# Altium project CT_Entire_Project.PrjPcb
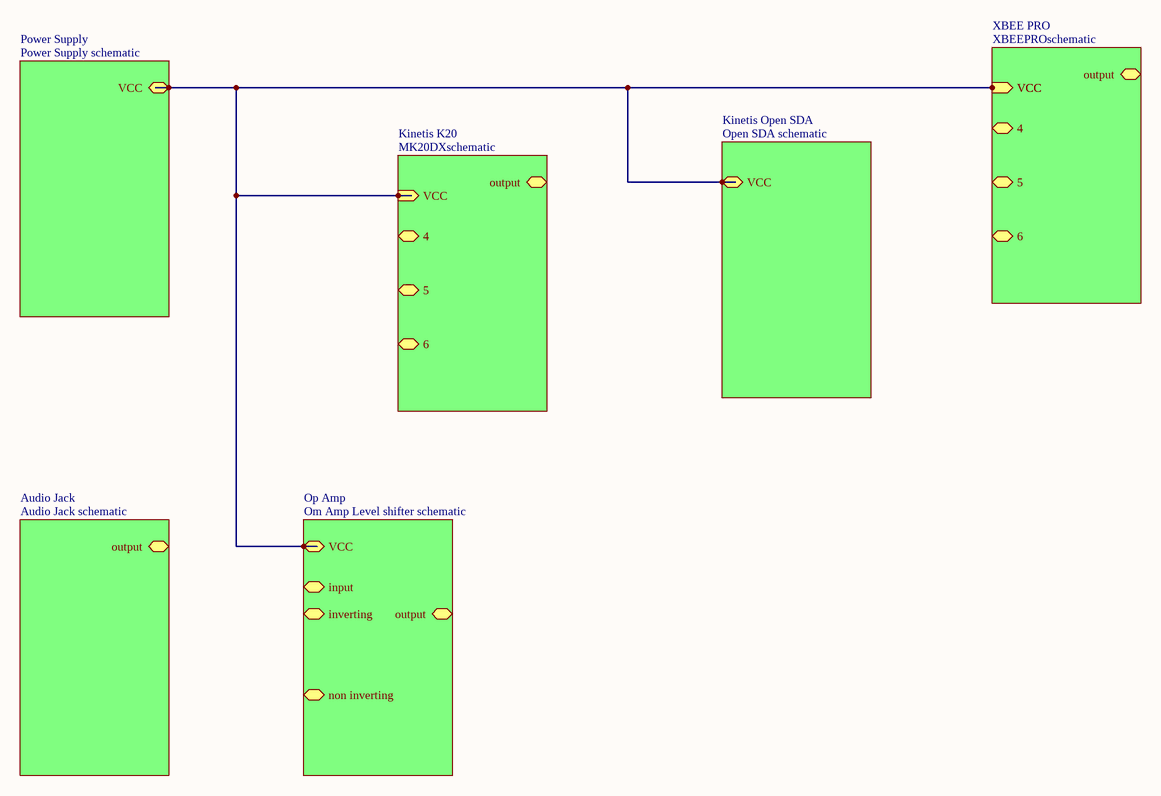
[diagram p0: CT_MET_2.SchDoc]
5 sheets, 18 parts. Net scope: hierarchical (ports join the sheet entries above them; power ports are global).
Sheets:
  CT_MET_2.SchDoc
    Power Supply = Power Supply schematic.SchDoc
    Kinetis K20 = MK20DXschematic.SchDoc
    XBEE PRO = XBEEPROschematic.SchDoc
    Kinetis Open SDA = Open SDA schematic.SchDoc

## Sheet CT_MET_2.SchDoc
size A4

### Sub-sheets
Audio Jack = Audio Jack schematic (file not in this document): output
Kinetis K20 = MK20DXschematic: output, 4, 5, 6, VCC (in)
Kinetis Open SDA = Open SDA schematic: VCC
Op Amp = Om Amp Level shifter schematic (file not in this document): inverting, output, non inverting, VCC, input
Power Supply = Power Supply schematic: VCC
XBEE PRO = XBEEPROschematic: output, VCC, 4, 5, 6, VCC (in)

### Nets
NetC?#3_1: sheet Op Amp/VCC, sheet Power Supply/VCC, sheet Kinetis K20/VCC, sheet XBEE PRO/VCC, sheet XBEE PRO/VCC, sheet Kinetis Open SDA/VCC

## Sheet Power Supply schematic.SchDoc
size A4
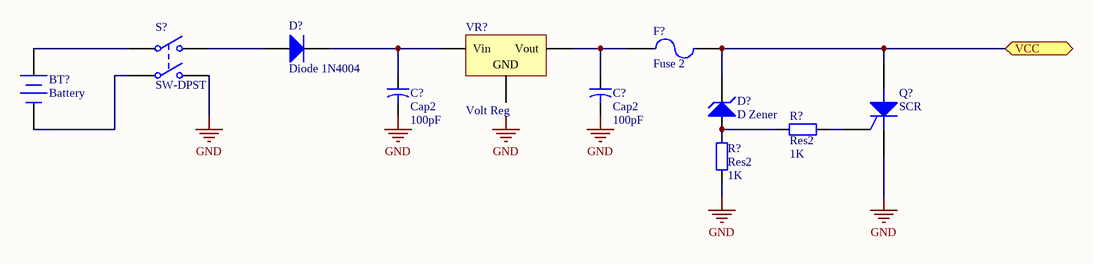
[diagram p1: Power Supply schematic.SchDoc]

### Parts
(Parts that share a designator on the sheet are numbered #1, #2 ... from top to bottom, then left to right.)
BT?  Battery  [BAT-2]
C?#1  Cap2  value 100pF  [CAPR5-4X5]
C?#2  Cap2  value 100pF  [CAPR5-4X5]
D?#1  Diode 1N4004  [DO-41]
D?#2  D Zener  [DIODE-0.7]
F?  Fuse 2  [PIN-W2/E2.8]
Q?  SCR  [TO-220-AB]
R?#1  Res2  value 1K  [AXIAL-0.4]
R?#2  Res2  value 1K  [AXIAL-0.4]
S?  SW-DPST  [DPST-4]
VR?  Volt Reg  [D2PAK_N]

### Ports
VCC

### Nets
GND: C?#1.2 C?#2.2 Q?.3(K) R?#2.1 S?.4(NO2)
NetBT?_1: BT?.1(+) S?.1(COMMON1)
NetBT?_2: BT?.2(-) S?.3(COMMON2)
NetC?#1_1: C?#1.1 D?#1.2(K) VR?.1(Vin)
NetC?#2_1: C?#2.1 F?.1 VR?.3(Vout)
NetC?#3_1: D?#2.2(K) F?.2 Q?.1(A) ; port VCC
NetD?#1_1: D?#1.1(A) S?.2(NO1)
NetD?#2_1: D?#2.1(A) R?#1.2 R?#2.2
NetQ?_2: Q?.2(G) R?#1.1

Not connected (* = marked no-connect by the designer): VR? 2(GND)

### Notes on the sheet
- Labels drawn without touching a wire or pin: GND

### Library data of the parts
BT? = Battery: Multicell Battery; Published: 24-Mar-1999; LatestRevisionDate: 17-Jul-2002; LatestRevisionNote: Re-released for DXP Platform.; PackageReference: BAT-2; Publisher: Altium Limited; PackageDescription: Battery; 2 Leads
C?#1 C?#2 = Cap2: Capacitor; Published: 23-Sep-2002; PackageReference: CAPR5-4X5; Publisher: Altium Limited; PackageDescription: Capacitor; 2 Leads
D?#1 = Diode 1N4004: 1 Amp General Purpose Rectifier; Published: 8-Jun-2000; LatestRevisionDate: 17-Jul-2002; LatestRevisionNote: Re-released for DXP Platform.; DatasheetVersion: 1998; PackageVersion: Aug-1999; PackageReference: DO-41; Publisher: Altium Limited; PackageDescription: Diode, Axial; Body 5.2 x 2.7 mm (LxDia. max), Lead Dia. 0.86 mm (max); Code_JEDEC: DO-204-AL; ComponentLink1Description: Manufacturer Link; ComponentLink1URL: http://www.fairchildsemi.com/; ComponentLink2Description: Datasheet; ComponentLink2URL: http://www.fairchildsemi.com/ds/1N%2F1N4001.pdf
D?#2 = D Zener: Zener Diode; Published: 8-Jun-2000; LatestRevisionDate: 17-Jul-2002; LatestRevisionNote: Re-released for DXP Platform.; PackageReference: DIODE-0.7; Publisher: Altium Limited; PackageDescription: Diode, Thru-Hole; 2 Leads; 0.7 in Pin Spacing
F? = Fuse 2: Fuse; Published: 8-Jun-2000; LatestRevisionDate: 17-Jul-2002; LatestRevisionNote: Re-released for DXP Platform.; PackageReference: PIN-W2/E2.8; Publisher: Altium Limited; PackageDescription: Thru-Hole; 2 Leads
Q? = SCR: Silicon Controlled Rectifier; Published: 8-Jun-2000; LatestRevisionDate: 17-Jul-2002; LatestRevisionNote: Re-released for DXP Platform.; PackageReference: TO-220-AB; Publisher: Altium Limited; Code_JEDEC: TO-220-AB
R?#1 R?#2 = Res2: Resistor; Published: 8-Jun-2000; LatestRevisionDate: 17-Jul-2002; LatestRevisionNote: Re-released for DXP Platform.; PackageReference: AXIAL-0.4; Publisher: Altium Limited; PackageDescription: Axial Device, Thru-Hole; 2 Leads; 0.4 in Pin Spacing
S? = SW-DPST: Double-Pole, Single-Throw Switch; Published: 24-Mar-1999; LatestRevisionDate: 17-Jul-2002; LatestRevisionNote: Re-released for DXP Platform.; PackageReference: DPST-4; Publisher: Altium Limited; PackageDescription: Switch; 4 Leads
VR? = Volt Reg: Voltage Regulator; Published: 24-Mar-1999; LatestRevisionDate: 29-May-2009; LatestRevisionNote: IPC-7351 Footprint Added.; PackageReference: D2PAK; Publisher: Altium Limited; PackageDescription: 3-Pin Transistor Outline Package 2.54 mm Pitch, 15.1 mm Lead Span

## Sheet MK20DXschematic.SchDoc
size A4
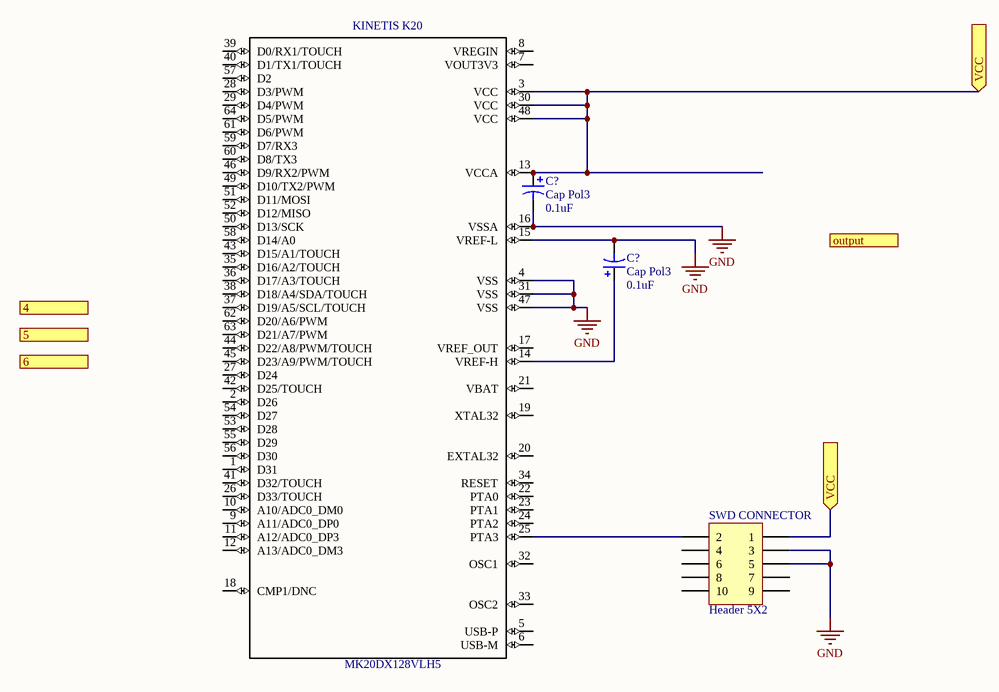
[diagram p2: MK20DXschematic.SchDoc]

### Parts
(Parts that share a designator on the sheet are numbered #1, #2 ... from top to bottom, then left to right.)
C?#3  Cap Pol3  value 0.1uF  [C0805]
C?#4  Cap Pol3  value 0.1uF  [C0805]
KINETIS_K20  MK20DX128VLH5  [QFP50P1200X1200X160-64N]
SWD_CONNECTOR  Header 5X2  [HDR2X5]

### Ports
4, 5, 6, output, VCC (in)

### Nets
GND: C?#3.2 C?#4.2 KINETIS_K20.4(VSS) KINETIS_K20.15(VREF-L) KINETIS_K20.16(VSSA) KINETIS_K20.31(VSS) KINETIS_K20.47(VSS) SWD_CONNECTOR.3 SWD_CONNECTOR.5
NetC?#3_1: C?#3.1 KINETIS_K20.3(VCC) KINETIS_K20.13(VCCA) KINETIS_K20.30(VCC) KINETIS_K20.48(VCC) SWD_CONNECTOR.1 ; port VCC
NetC?#4_1: C?#4.1 KINETIS_K20.14(VREF-H)
NetKINETIS_K20_25: KINETIS_K20.25(PTA3) SWD_CONNECTOR.2

Not connected (* = marked no-connect by the designer): KINETIS_K20 1(D31) 2(D26) 5(USB-P) 6(USB-M) 7(VOUT3V3) 8(VREGIN) 9(A11/ADC0_DP0) 10(A10/ADC0_DM0) 11(A12/ADC0_DP3) 12(A13/ADC0_DM3) 17(VREF_OUT) 18(CMP1/DNC) 19(XTAL32) 20(EXTAL32) 21(VBAT) 22(PTA0) 23(PTA1) 24(PTA2) 26(D33/TOUCH) 27(D24) 28(D3/PWM) 29(D4/PWM) 32(OSC1) 33(OSC2) 34(RESET) 35(D16/A2/TOUCH) 36(D17/A3/TOUCH) 37(D19/A5/SCL/TOUCH) 38(D18/A4/SDA/TOUCH) 39(D0/RX1/TOUCH) 40(D1/TX1/TOUCH) 41(D32/TOUCH) 42(D25/TOUCH) 43(D15/A1/TOUCH) 44(D22/A8/PWM/TOUCH) 45(D23/A9/PWM/TOUCH) 46(D9/RX2/PWM) 49(D10/TX2/PWM) 50(D13/SCK) 51(D11/MOSI) 52(D12/MISO) 53(D28) 54(D27) 55(D29) 56(D30) 57(D2) 58(D14/A0) 59(D7/RX3) 60(D8/TX3) 61(D6/PWM) 62(D20/A6/PWM) 63(D21/A7/PWM) 64(D5/PWM); SWD_CONNECTOR 4 6 7 8 9 10

### Library data of the parts
C?#3 C?#4 = Cap Pol3: Polarized Capacitor (Surface Mount); Published: 8-Jun-2000; LatestRevisionDate: 29-May-2009; LatestRevisionNote: IPC-7351 Footprint Added.; PackageReference: C0805; Publisher: Altium Limited; PackageDescription: Chip Capacitor
KINETIS_K20 = MK20DX128VLH5: MCU 32-bit Kinetis K20 ARM Cortex M4 RISC 128KB Flash 1.8V/2.5V/3.3V 64-Pin LQFP Tray; pin to pad: 17>none; MF: NXP Semiconductors; Package: LQFP-64 NXP Semiconductors; Price: 4.22 USD; MP: MK20DX128VLH5; Availability: Good; Value: *
SWD_CONNECTOR = Header 5X2: Header, 5-Pin, Dual row; LatestRevisionDate: 17-Jul-2002; LatestRevisionNote: Re-released for DXP Platform.; Publisher: Altium Limited

## Sheet XBEEPROschematic.SchDoc
size A4
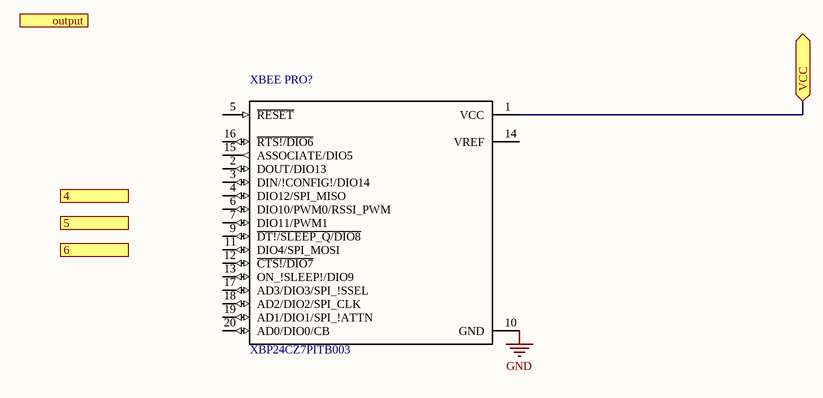
[diagram p3: XBEEPROschematic.SchDoc]

### Parts
XBEE_PRO?  XBP24CZ7PITB003  [DIP2200W51P200L3294H279Q20P]

### Ports
4, 5, 6, output, VCC

### Nets
GND: XBEE_PRO?.10(GND)
NetC?#3_1: XBEE_PRO?.1(VCC) ; port VCC

Not connected (* = marked no-connect by the designer): XBEE_PRO? 2(DOUT/DIO13) 3(DIN/!CONFIG!/DIO14) 4(DIO12/SPI_MISO) 5(~{RESET}) 6(DIO10/PWM0/RSSI_PWM) 7(DIO11/PWM1) 9(~{D}T~{!/SLEEP}_~{Q/DIO8}) 11(DIO4/SPI_MOSI) 12(~{CTS!/DIO7}) 13(ON_!SLEEP!/DIO9) 14(VREF) 15(ASSOCIATE/DIO5) 16(~{RTS!/DIO6}) 17(AD3/DIO3/SPI_!SSEL) 18(AD2/DIO2/SPI_CLK) 19(AD1/DIO1/SPI_!ATTN) 20(AD0/DIO0/CB)

### Library data of the parts
XBEE_PRO? = XBP24CZ7PITB003: Programmable Xbee-Pro Zb S2c Th %28Pcb Antenna%29; MF: Digi International; Package: Module Digi International; Price: 31.31 USD; MP: XBP24CZ7PITB003; Availability: Bad; Value: *

## Sheet Open SDA schematic.SchDoc
size A4
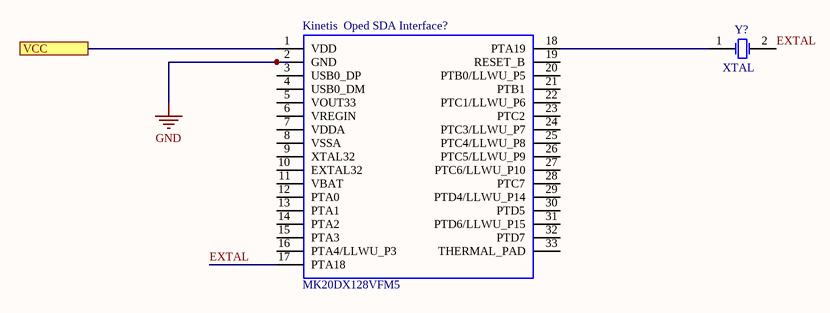
[diagram p4: Open SDA schematic.SchDoc]

### Parts
Kinetis_Oped_SDA_Interface?  MK20DX128VFM5  [SOT617-14]
Y?  XTAL  [R38]

### Ports
VCC

### Nets
GND: Kinetis_Oped_SDA_Interface?.2(GND)
EXTAL: Kinetis_Oped_SDA_Interface?.17(PTA18) Y?.2(OSC2)
NetC?#3_1: Kinetis_Oped_SDA_Interface?.1(VDD) ; port VCC
NetKinetis_Oped_SDA_Interface?_18: Kinetis_Oped_SDA_Interface?.18(PTA19) Y?.1(OSC1)

Not connected (* = marked no-connect by the designer): Kinetis_Oped_SDA_Interface? 3(USB0_DP) 4(USB0_DM) 5(VOUT33) 6(VREGIN) 7(VDDA) 8(VSSA) 9(XTAL32) 10(EXTAL32) 11(VBAT) 12(PTA0) 13(PTA1) 14(PTA2) 15(PTA3) 16(PTA4/LLWU_P3) 19(RESET_B) 20(PTB0/LLWU_P5) 21(PTB1) 22(PTC1/LLWU_P6) 23(PTC2) 24(PTC3/LLWU_P7) 25(PTC4/LLWU_P8) 26(PTC5/LLWU_P9) 27(PTC6/LLWU_P10) 28(PTC7) 29(PTD4/LLWU_P14) 30(PTD5) 31(PTD6/LLWU_P15) 32(PTD7) 33(THERMAL_PAD)

### Library data of the parts
Kinetis_Oped_SDA_Interface? = MK20DX128VFM5: MCU, Kinetis, MK20DX128VFM5, QFN32 Freescale MK20DX128VFM5, 32bit ARM Cortex M4 MCU, 50MHz, 160 kB Flash, 32-Pin QFN; Manufacturer_Name: NXP; Geometry.Height: mm; Supplier_Name: RS; RS Part Number: 8181223; Manufacturer_Part_Number: MK20DX128VFM5; Allied_Number: *; Other Part Number: *; Datasheet Link: http://www.nxp.com/docs/en/data-sheet/K20P32M50SF0.pdf; 3D Package: *
Y? = XTAL: Crystal Oscillator; Published: 8-Jun-2000; LatestRevisionDate: 17-Jul-2002; LatestRevisionNote: Re-released for DXP Platform.; PackageReference: R38; Publisher: Altium Limited; PackageDescription: Crystal, Thru-Hole; 2 Leads; Body 3.1 x 8.2 mm (Dia.xH)

## Nets that join several sheets
GND: Power Supply schematic (5 pins), MK20DXschematic (9 pins), XBEEPROschematic (XBEE_PRO?.10), Open SDA schematic (Kinetis_Oped_SDA_Interface?.2)
NetC?#3_1: Power Supply schematic (D?#2.2 F?.2 Q?.1), MK20DXschematic (6 pins), XBEEPROschematic (XBEE_PRO?.1), Open SDA schematic (Kinetis_Oped_SDA_Interface?.1)